# Altium project FuseBoard.PrjPCB
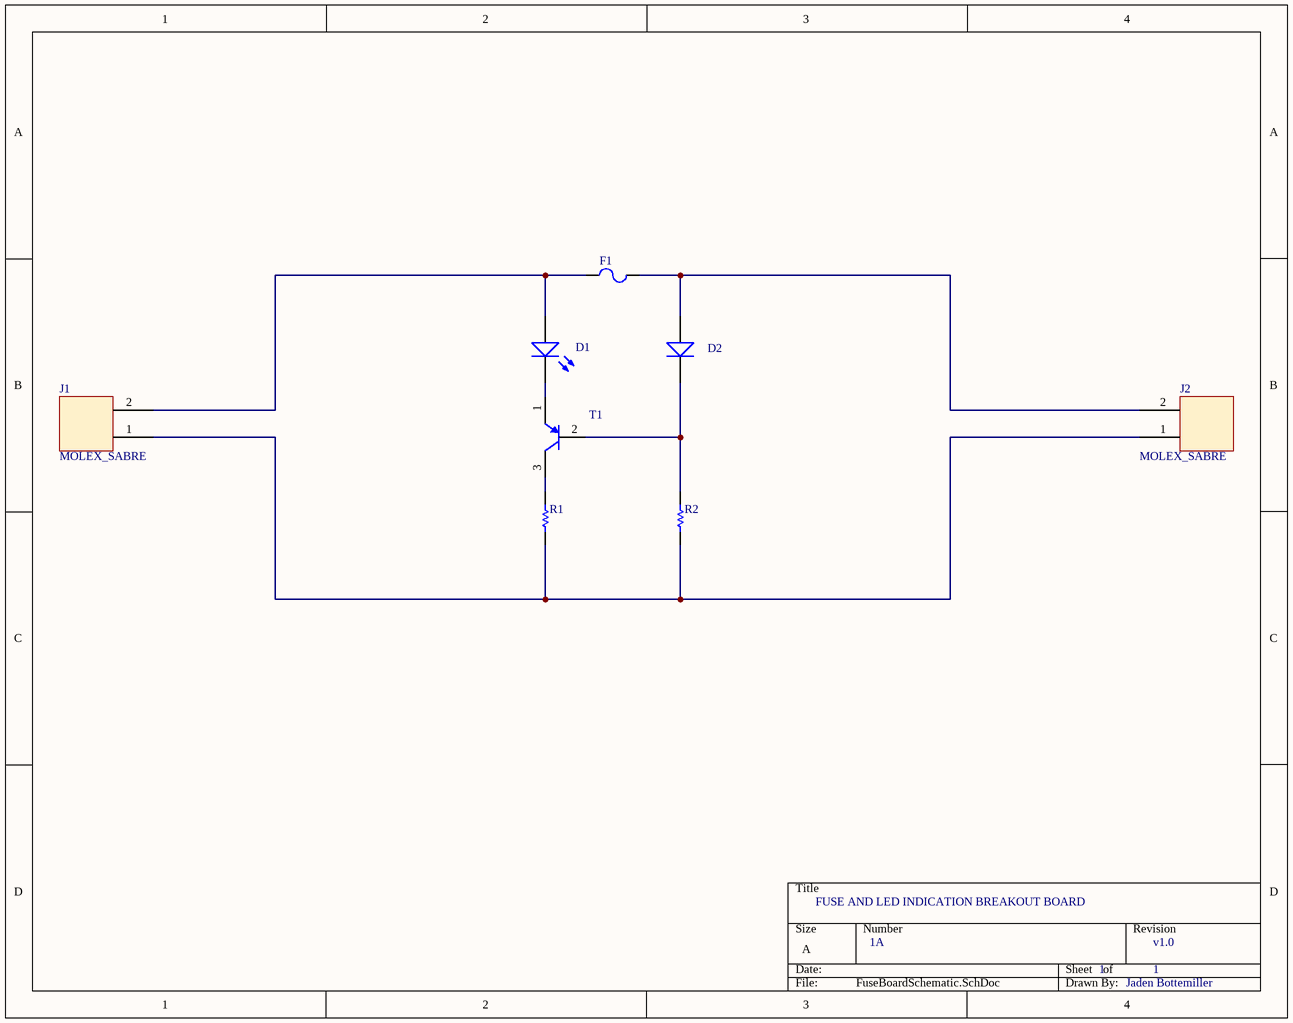
[diagram p0: FuseBoardSchematic.SchDoc]
1 sheet, 8 parts. Net scope: global (net labels, ports and power ports of the same name join across sheets).
Board file: FuseBoardPCB.PcbDoc

## Sheet FuseBoardSchematic.SchDoc
size A

### Parts
D1  LED  [DIOC1608X08L]  (value not drawn)
D2  DIODE  [DIOC5226X24L]  (value not drawn)
F1  FUSE  [FUSE HOLDER]  (value not drawn)
J1  MOLEX_SABRE  [1720420202]
J2  MOLEX_SABRE  [1720420202]
R1  RES  [RESC3115X06L]  (value not drawn)
R2  RES  [RESC3115X06L]  (value not drawn)
T1  PNP  [SOT100P240X110-3N]  (value not drawn)

### Nets
NetD1_A: D1.A F1.1 J1.2(Pin)
NetD1_C: D1.C T1.1(E1)
NetD2_A: D2.A F1.2 J2.2(Pin)
NetD2_C: D2.C R2.1 T1.2(B1)
NetJ1_1: J1.1(Pin) J2.1(Pin) R1.2 R2.2
NetR1_1: R1.1 T1.3(C1)

### Notes on the sheet
- FUSE AND LED INDICATION BREAKOUT BOARD
- 1A
- 1
- v1.0
- Jaden Bottemiller

### Library data of the parts
D1 = LED: pin to pad: A>2 C>1
D2 = DIODE: pin to pad: A>2 C>1
T1 = PNP: pin to pad: 1>2 2>1